# EAGLE schematic 4_bit_ALU (EAGLE 8.3.2)
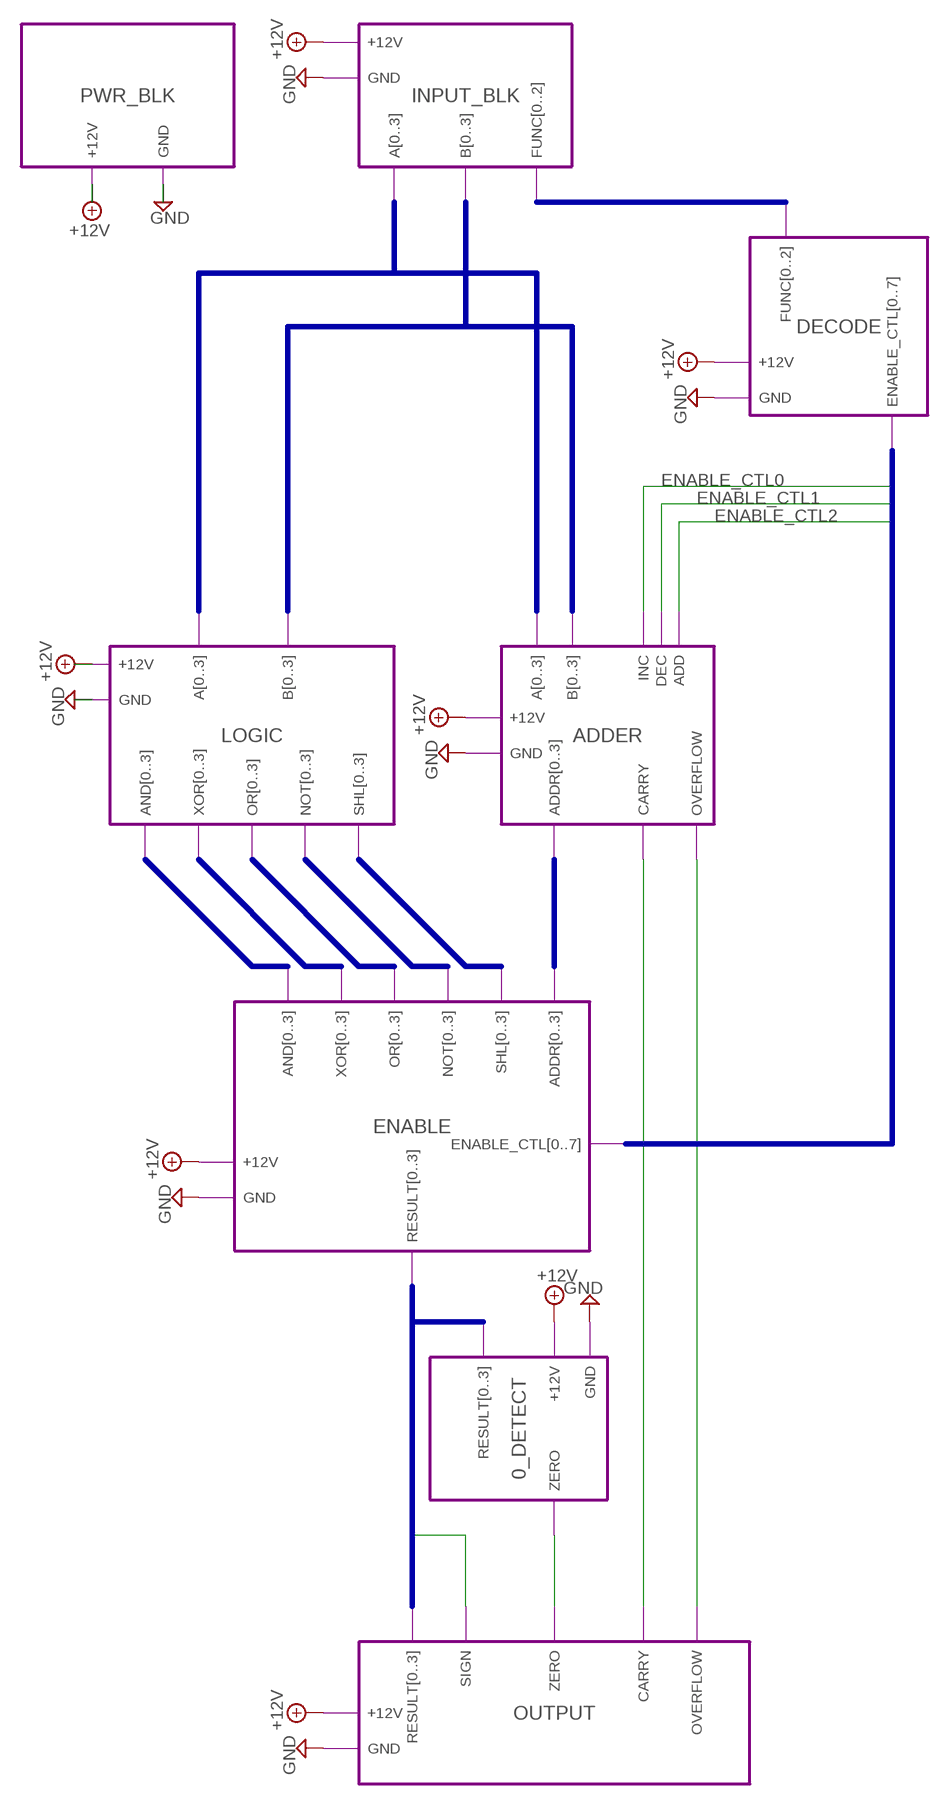
[diagram p0: schematic, sheet 1]

## Module instances
INPUT_BLK = INPUT_BLK
DECODE = 3-8_DECODER
ADDER = ADDER
LOGIC = LOGIC
ENABLE = ENABLE
0_DETECT = 0_DETECT
OUTPUT = OUTPUT
PWR_BLK = PWR_BLK

## Nets
+12V: port DECODE.+12V ADDER.+12V LOGIC.+12V ENABLE.+12V OUTPUT.+12V 0_DETECT.+12V INPUT_BLK.+12V PWR_BLK.+12V
CARRY: port ADDER.CARRY OUTPUT.CARRY
ENABLE_CTL0: port ADDER.INC
ENABLE_CTL1: port ADDER.DEC
ENABLE_CTL2: port ADDER.ADD
GND: port DECODE.GND ADDER.GND LOGIC.GND ENABLE.GND OUTPUT.GND 0_DETECT.GND INPUT_BLK.GND PWR_BLK.GND
OVERFLOW: port ADDER.OVERFLOW OUTPUT.OVERFLOW
RESULT0: port OUTPUT.SIGN
ZERO: port 0_DETECT.ZERO OUTPUT.ZERO

## Buses
FUNC[0..2]
ENABLE_CTL[0..7]
A[0..3]
B[0..3]
AND[0..3]
XOR[0..3]
OR[0..3]
NOT[0..3]
SHL[0..3]
ADDR[0..3]
RESULT[0..3]

## Library data of the parts

## Module INPUT_BLK
Ports: A[0..3](out) B[0..3](out) FUNC[0..2](out) +12V(pwr) GND(pwr)
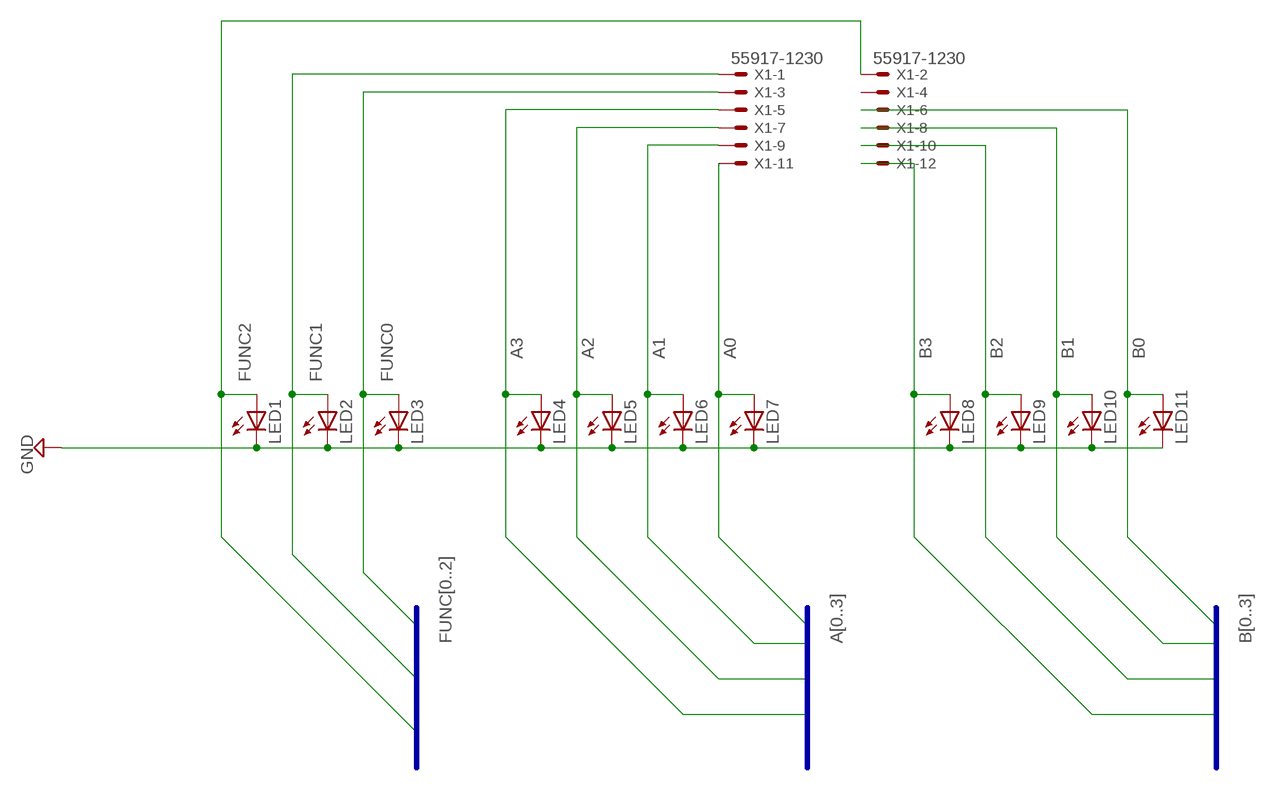
[diagram p1: schematic, module INPUT_BLK, sheet 1]

### Parts
LED1  LED3MM  [LED3MM]
LED2  LED3MM  [LED3MM]
LED3  LED3MM  [LED3MM]
LED4  LED3MM  [LED3MM]
LED5  LED3MM  [LED3MM]
LED6  LED3MM  [LED3MM]
LED7  LED3MM  [LED3MM]
LED8  LED3MM  [LED3MM]
LED9  LED3MM  [LED3MM]
LED10  LED3MM  [LED3MM]
LED11  LED3MM  [LED3MM]
X1  55917-1230  [55917-1230]

### Nets
A0: LED7.A X1.11
A1: LED6.A X1.9
A2: LED5.A X1.7
A3: LED4.A X1.5
B0: LED11.A X1.6
B1: LED10.A X1.8
B2: LED9.A X1.10
B3: LED8.A X1.12
FUNC0: LED3.A X1.3
FUNC1: LED2.A X1.1
FUNC2: LED1.A X1.2
GND: LED1.K(C) LED2.K(C) LED3.K(C) LED4.K(C) LED5.K(C) LED6.K(C) LED7.K(C) LED8.K(C) LED9.K(C) LED10.K(C) LED11.K(C)
Unconnected: X1.4

### Buses
FUNC[0..2]
A[0..3]
B[0..3]

### Library data of the parts
LED1-LED11 = relay_computer_custom:LED: VCC 12V LED w/ built-in resistor
X1 = relay_computer_custom:55917-1230: 12 Pin - 2mm Dual Row Single Wafer, Vertical T/H HDR Source: http://www.molex.com/pdm_docs/sd/559171230_sd.pdf; MPN: 55917-1230; OC_FARNELL: unknown; OC_NEWARK: unknown

## Module 3-8_DECODER
Ports: FUNC[0..2](in) ENABLE_CTL[0..7](out) +12V(pwr) GND(pwr)
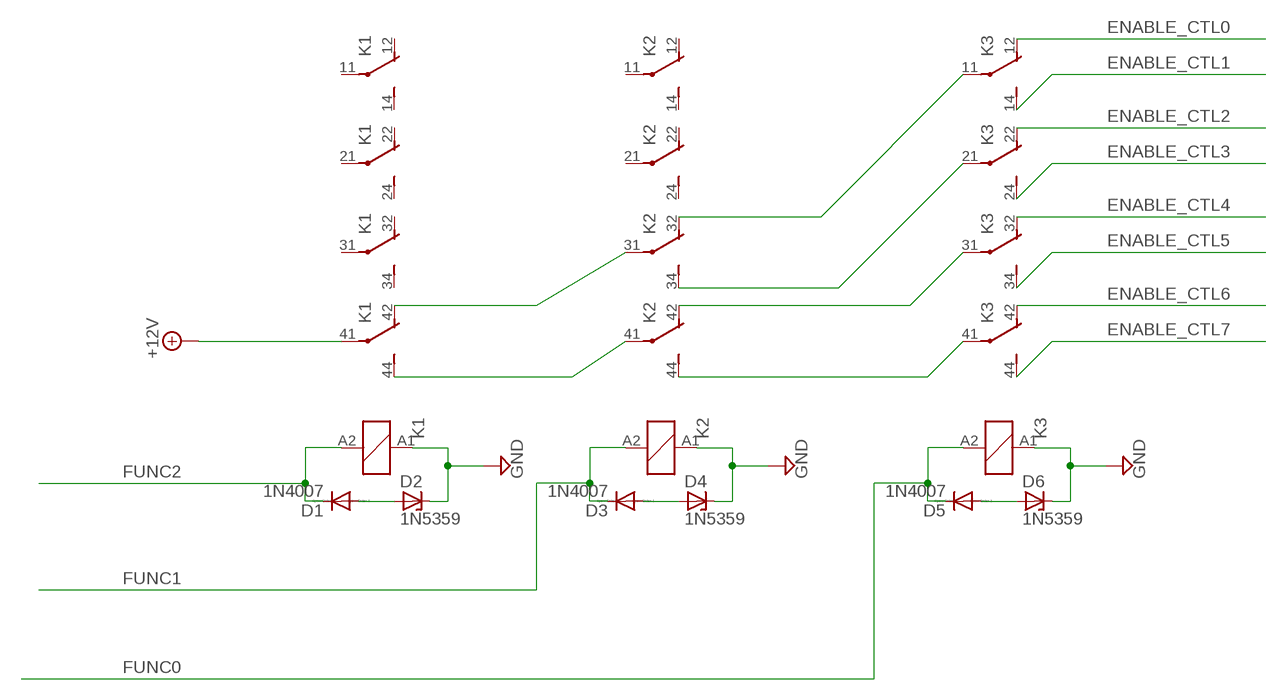
[diagram p2: schematic, module 3-8_DECODER, sheet 1]

### Parts
D1  1N4007  [DO41-10]
D2  1N5359  [C1702-15]
D3  1N4007  [DO41-10]
D4  1N5359  [C1702-15]
D5  1N4007  [DO41-10]
D6  1N5359  [C1702-15]
K1  PY14-02  [PY14-02]
K2  PY14-02  [PY14-02]
K3  PY14-02  [PY14-02]

### Nets
+12V: K1.41(5:P)
D$1: D1.A D2.A
D$2: D3.A D4.A
D$3: D5.A D6.A
ENABLE_CTL0: K3.12(2:O)
ENABLE_CTL1: K3.14(2:S)
ENABLE_CTL2: K3.22(3:O)
ENABLE_CTL3: K3.24(3:S)
ENABLE_CTL4: K3.32(4:O)
ENABLE_CTL5: K3.34(4:S)
ENABLE_CTL6: K3.42(5:O)
ENABLE_CTL7: K3.44(5:S)
FUNC0: D5.C K3.A2
FUNC1: D3.C K2.A2
FUNC2: D1.C K1.A2
GND: D2.C D4.C D6.C K1.A1 K2.A1 K3.A1
N$1: K1.44(5:S) K2.41(5:P)
N$2: K1.42(5:O) K2.31(4:P)
N$3: K2.44(5:S) K3.41(5:P)
N$4: K2.42(5:O) K3.31(4:P)
N$5: K2.34(4:S) K3.21(3:P)
N$6: K2.32(4:O) K3.11(2:P)
Unconnected: K1.11(2:P) K1.12(2:O) K1.14(2:S) K1.21(3:P) K1.22(3:O) K1.24(3:S) K1.31(4:P) K1.32(4:O) K1.34(4:S) K2.11(2:P) K2.12(2:O) K2.14(2:S) K2.21(3:P) K2.22(3:O) K2.24(3:S)

### Library data of the parts
D1 D3 D5 = relay_computer_custom:1N4007: DIODE general purpose rectifier, 1 A
D2 D4 D6 = relay_computer_custom:1N5359: Z DIODE 24 V, 5W
K1-K3 = relay_computer_custom:PY14-02: Miniature Relay OMRON 12VDC 4PDT 3A Relay Relay: MY4DC12 https://octopart.com/my4dc12-omron-13160135 Socket: PY14-02 https://octopart.com/py14-02-omron-113738

## Module ADDER
Ports: A[0..3](in) B[0..3](in) INC(in) DEC(in) ADD(in) ADDR[0..3](out) CARRY(out) OVERFLOW(out) +12V(pwr) GND(pwr)

### Library data of the parts

## Module ENABLE
Ports: AND[0..3](in) XOR[0..3](in) OR[0..3](in) NOT[0..3](in) ADDR[0..3](in) ENABLE_CTL[0..7](in) RESULT[0..3](out) SHL[0..3](in) +12V(pwr) GND(pwr)

### Library data of the parts

## Module 0_DETECT
Ports: RESULT[0..3](in) ZERO(out) +12V(pwr) GND(pwr)

### Library data of the parts

## Module OUTPUT
Ports: RESULT[0..3](in) SIGN(in) ZERO(in) CARRY(in) OVERFLOW(in) +12V(pwr) GND(pwr)

### Library data of the parts

## Module PWR_BLK
Ports: +12V(pwr) GND(pwr)
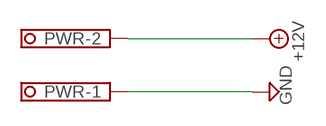
[diagram p3: schematic, module PWR_BLK, sheet 1]

### Parts
PWR  PWR_BLK  [1751248]

### Nets
+12V: PWR.2
GND: PWR.1

### Library data of the parts
PWR = relay_computer_custom:PWR_BLK: MKDS 1/ 2-3,5 Printklemme Nennstrom: 10 A Bemessungsspannung: 160 V Raster: 3,5 mm Polzahl: 2 Montageart: Löten Anschlussart: Schraubanschluss Anschlussrichtung vom Leiter zur Platine: 0° Source: http://eshop.phoenixcontact.com .. 1751248.pdf; OC_FARNELL: unknown; OC_NEWARK: unknown

## Module 1_BIT_LOGIC
Ports: X(in) Y(in) +12V(pwr) GND(pwr) AND(out) XOR(out) OR(out) NOT(out)
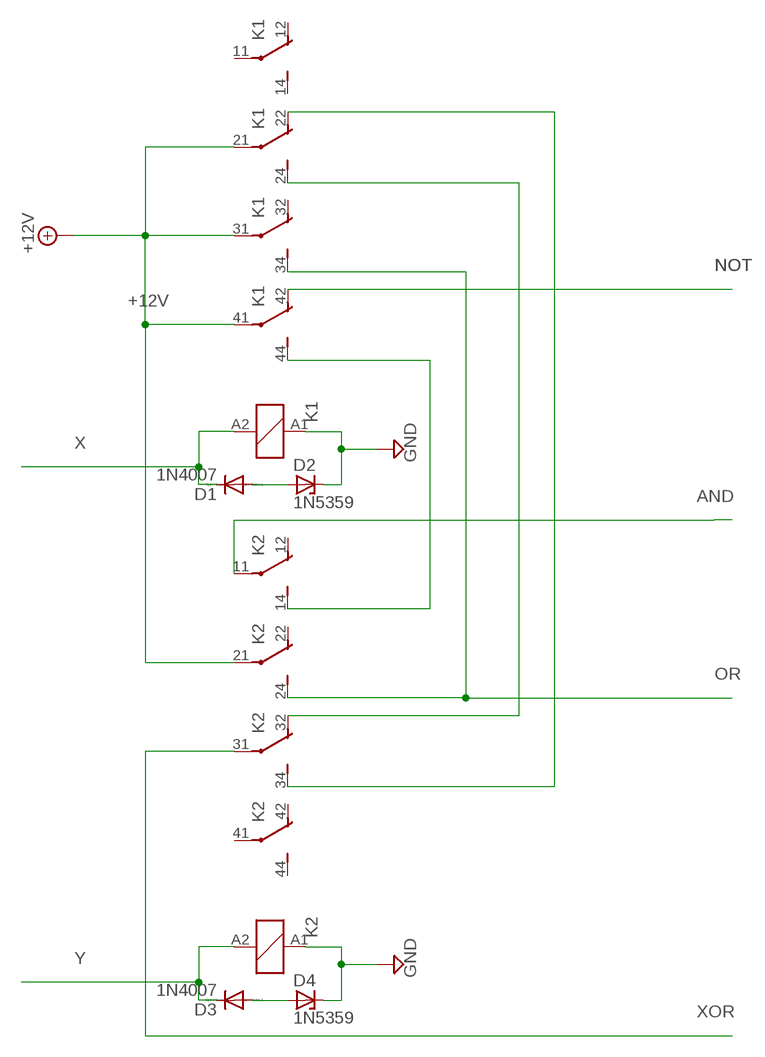
[diagram p4: schematic, module 1_BIT_LOGIC, sheet 1]

### Parts
D1  1N4007  [DO41-10]
D2  1N5359  [C1702-15]
D3  1N4007  [DO41-10]
D4  1N5359  [C1702-15]
K1  PY14-02  [PY14-02]
K2  PY14-02  [PY14-02]

### Nets
+12V: K1.21(3:P) K1.31(4:P) K1.41(5:P) K2.21(3:P)
AND: K2.11(2:P)
D$1: D1.A D2.A
D$2: D3.A D4.A
GND: D2.C D4.C K1.A1 K2.A1
N$1: K1.44(5:S) K2.14(2:S)
N$2: K1.24(3:S) K2.32(4:O)
N$3: K1.22(3:O) K2.34(4:S)
NOT: K1.42(5:O)
OR: K1.34(4:S) K2.24(3:S)
X: D1.C K1.A2
XOR: K2.31(4:P)
Y: D3.C K2.A2
Unconnected: K1.11(2:P) K1.12(2:O) K1.14(2:S) K1.32(4:O) K2.12(2:O) K2.22(3:O) K2.41(5:P) K2.42(5:O) K2.44(5:S)

### Library data of the parts
D1 D3 = relay_computer_custom:1N4007: DIODE general purpose rectifier, 1 A
D2 D4 = relay_computer_custom:1N5359: Z DIODE 24 V, 5W
K1 K2 = relay_computer_custom:PY14-02: Miniature Relay OMRON 12VDC 4PDT 3A Relay Relay: MY4DC12 https://octopart.com/my4dc12-omron-13160135 Socket: PY14-02 https://octopart.com/py14-02-omron-113738

## Module LOGIC
Ports: A[0..3](in) B[0..3](in) AND[0..3](out) OR[0..3](out) XOR[0..3](out) NOT[0..3](out) SHL[0..3](out) +12V(pwr) GND(pwr)
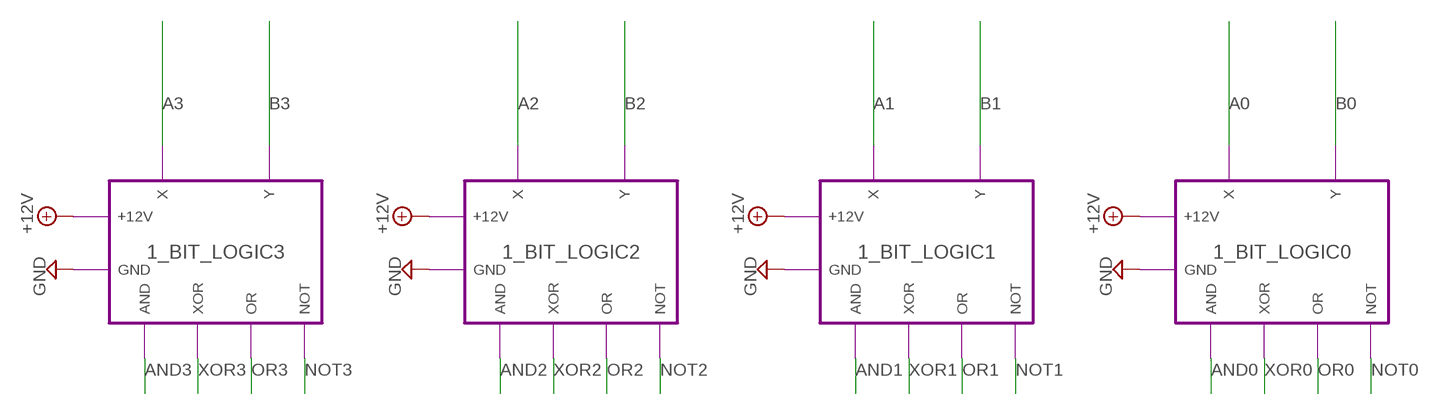
[diagram p5: schematic, module LOGIC, sheet 1]

### Module instances
1_BIT_LOGIC0 = 1_BIT_LOGIC
1_BIT_LOGIC1 = 1_BIT_LOGIC
1_BIT_LOGIC2 = 1_BIT_LOGIC
1_BIT_LOGIC3 = 1_BIT_LOGIC

### Nets
+12V: port 1_BIT_LOGIC0.+12V 1_BIT_LOGIC1.+12V 1_BIT_LOGIC2.+12V 1_BIT_LOGIC3.+12V
A0: port 1_BIT_LOGIC0.X
A1: port 1_BIT_LOGIC1.X
A2: port 1_BIT_LOGIC2.X
A3: port 1_BIT_LOGIC3.X
AND0: port 1_BIT_LOGIC0.AND
AND1: port 1_BIT_LOGIC1.AND
AND2: port 1_BIT_LOGIC2.AND
AND3: port 1_BIT_LOGIC3.AND
B0: port 1_BIT_LOGIC0.Y
B1: port 1_BIT_LOGIC1.Y
B2: port 1_BIT_LOGIC2.Y
B3: port 1_BIT_LOGIC3.Y
GND: port 1_BIT_LOGIC0.GND 1_BIT_LOGIC1.GND 1_BIT_LOGIC2.GND 1_BIT_LOGIC3.GND
NOT0: port 1_BIT_LOGIC0.NOT
NOT1: port 1_BIT_LOGIC1.NOT
NOT2: port 1_BIT_LOGIC2.NOT
NOT3: port 1_BIT_LOGIC3.NOT
OR0: port 1_BIT_LOGIC0.OR
OR1: port 1_BIT_LOGIC1.OR
OR2: port 1_BIT_LOGIC2.OR
OR3: port 1_BIT_LOGIC3.OR
XOR0: port 1_BIT_LOGIC0.XOR
XOR1: port 1_BIT_LOGIC1.XOR
XOR2: port 1_BIT_LOGIC2.XOR
XOR3: port 1_BIT_LOGIC3.XOR

### Library data of the parts